# EAGLE schematic backplane_v2 (EAGLE 7.6.0)
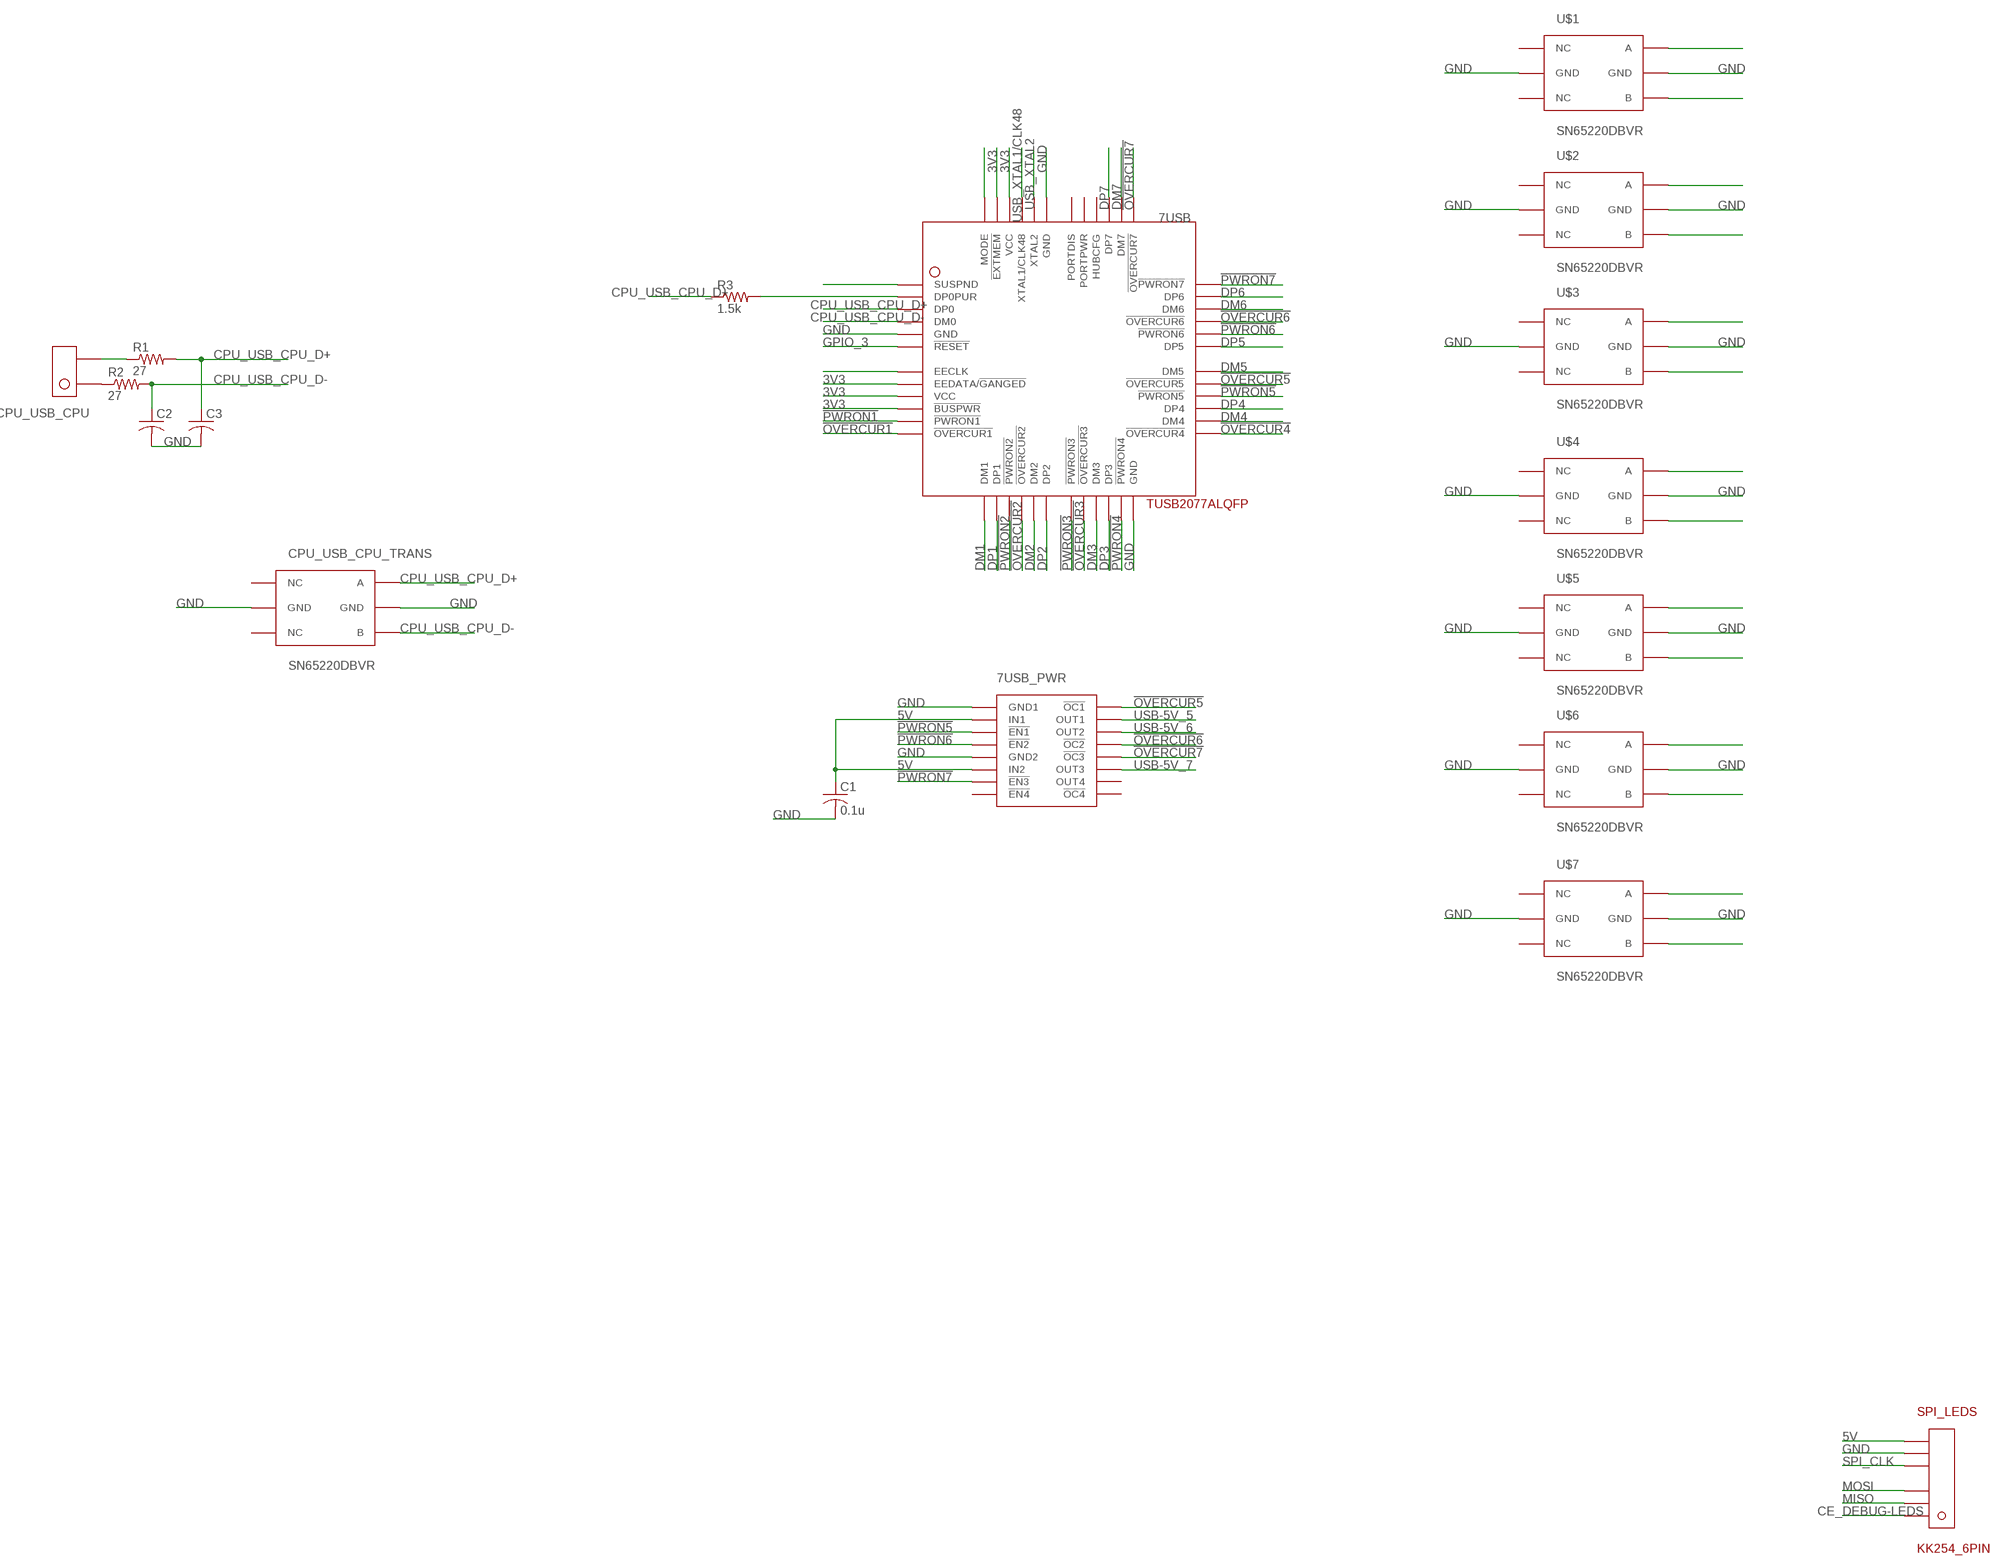
[diagram p0: schematic, sheet 1, part 1 of 2]
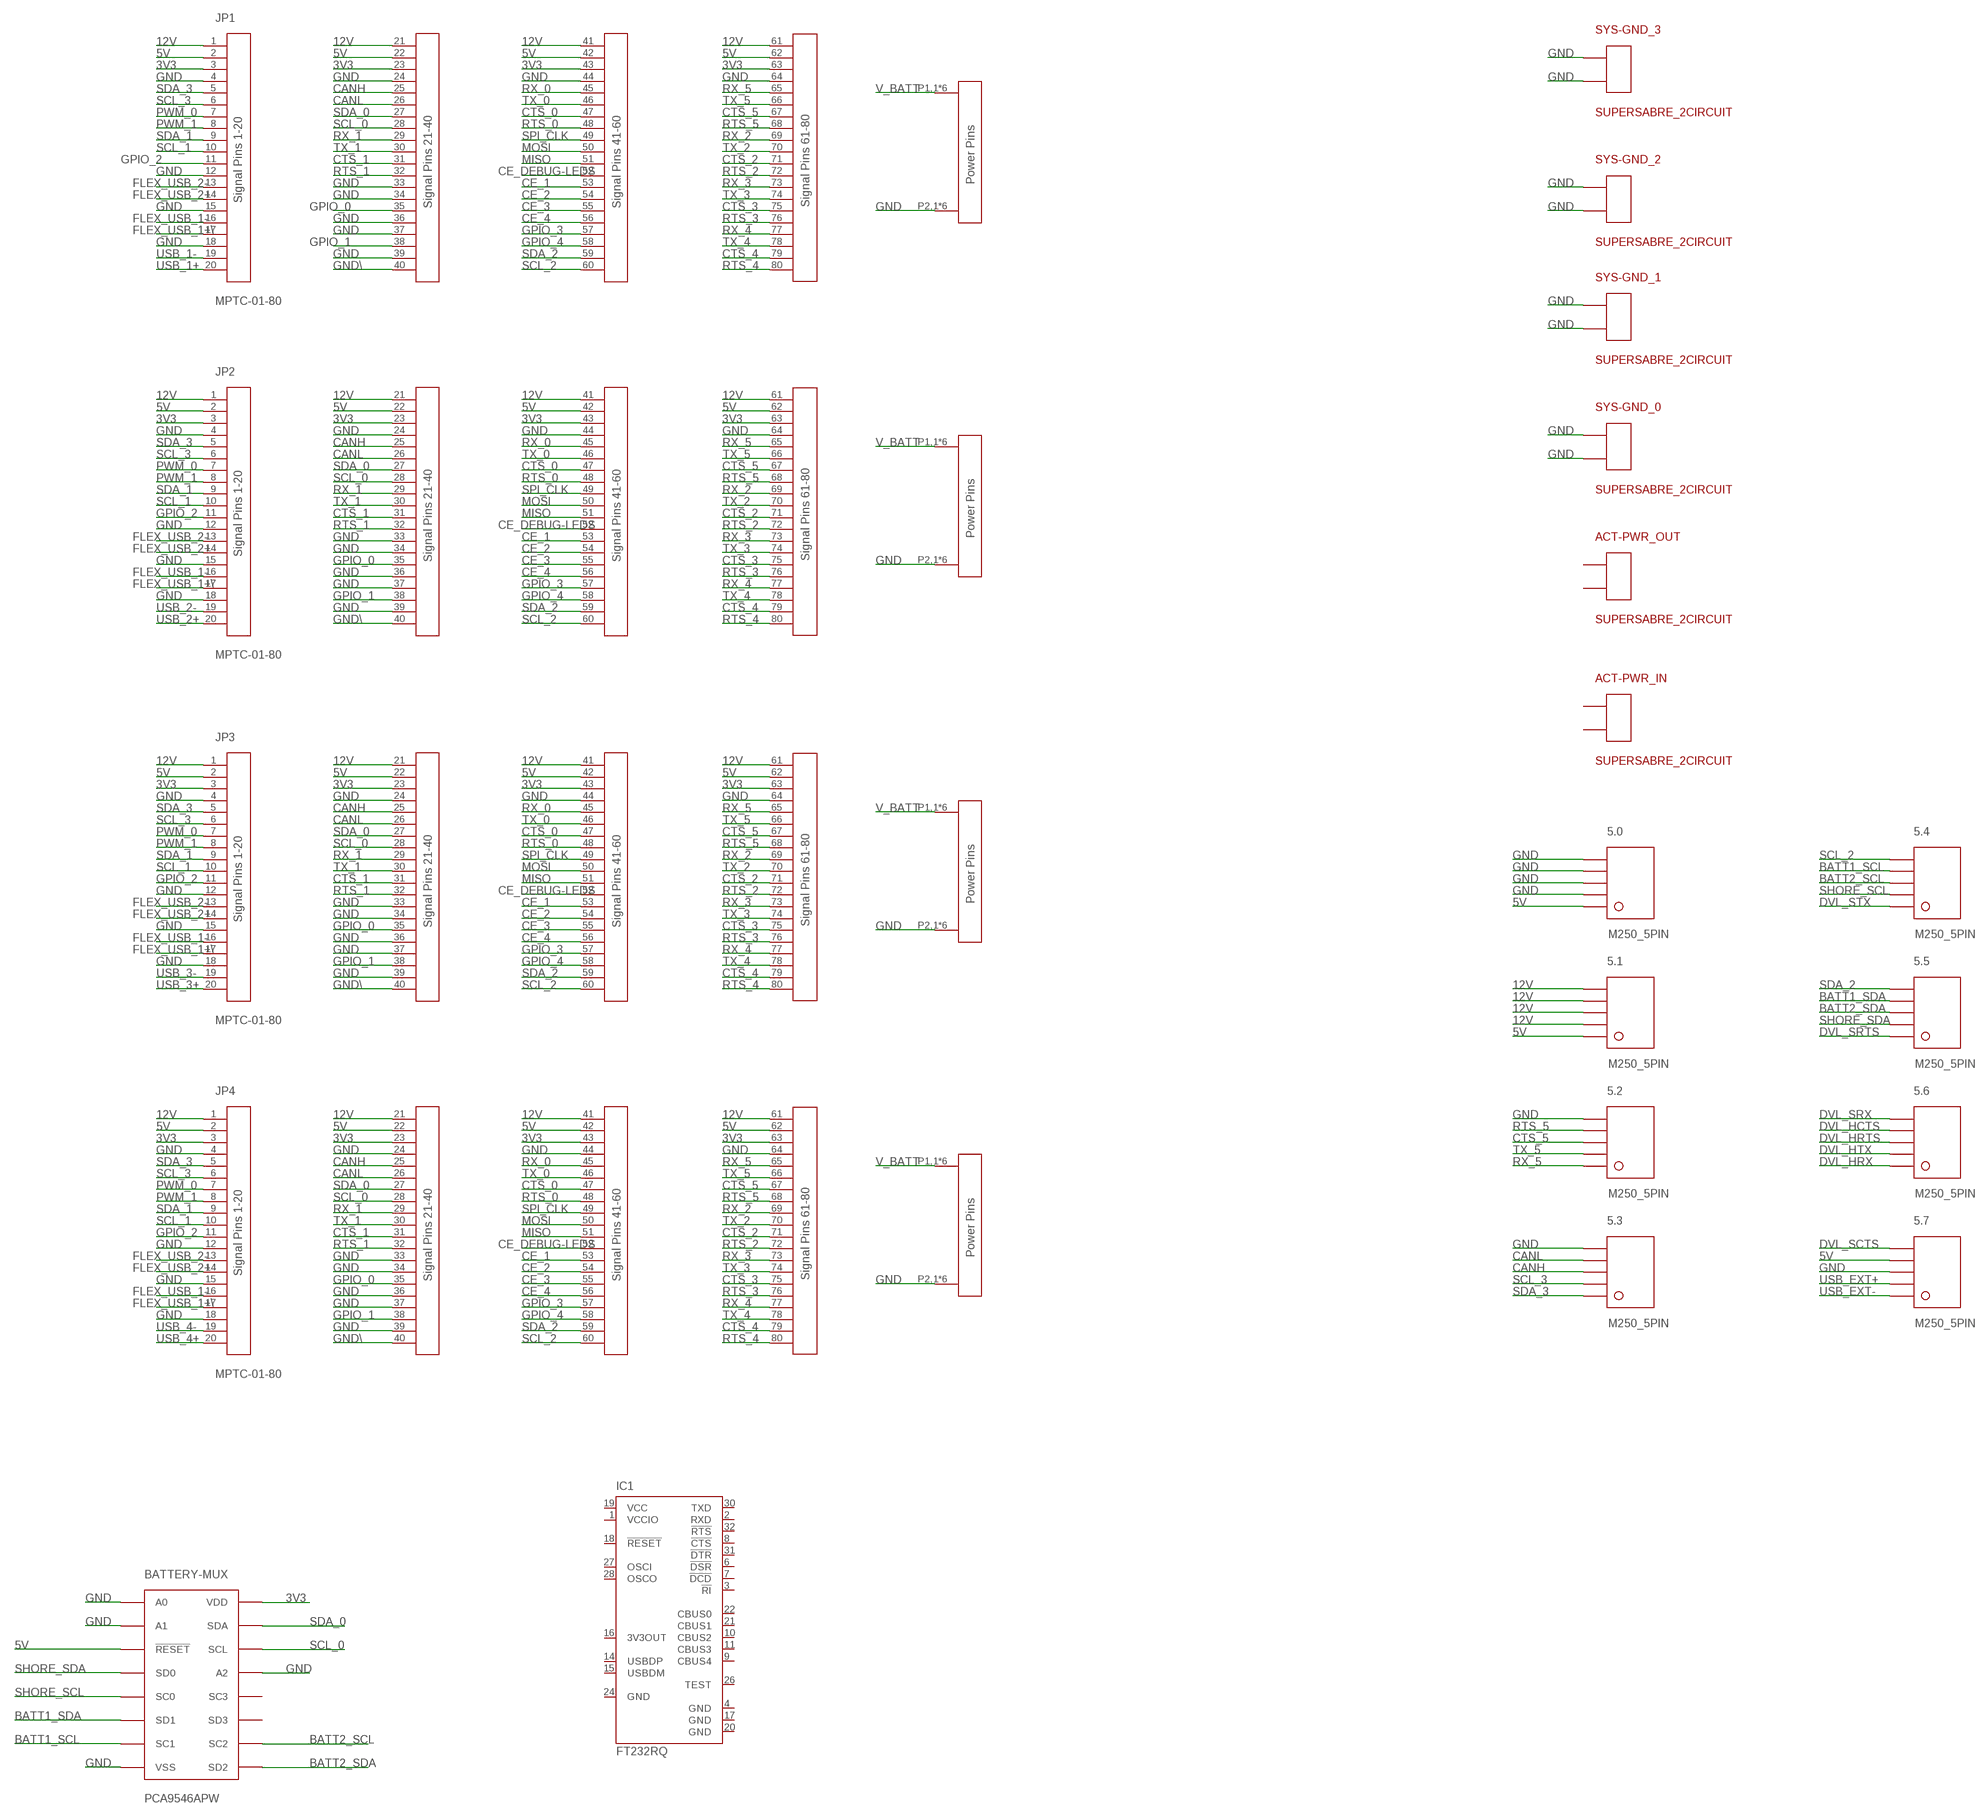
[diagram p1: schematic, sheet 1, part 2 of 2]

## Parts
5.0  M250_5PIN  [M205_5PIN]
5.1  M250_5PIN  [M205_5PIN]
5.2  M250_5PIN  [M205_5PIN]
5.3  M250_5PIN  [M205_5PIN]
5.4  M250_5PIN  [M205_5PIN]
5.5  M250_5PIN  [M205_5PIN]
5.6  M250_5PIN  [M205_5PIN]
5.7  M250_5PIN  [M205_5PIN]
7USB  TUSB2077ALQFP  [48-LQFP_0.5MM_PITCH]
7USB_PWR  TPS2044BBD-SOIC  [TPS2044]
ACT-PWR_IN  SUPERSABRE_2CIRCUIT  [SUPERSABRE_2CIRCUIT]
ACT-PWR_OUT  SUPERSABRE_2CIRCUIT  [SUPERSABRE_2CIRCUIT]
BATTERY-MUX  PCA9546APW  [TSSOP16]
C1  0.1u  C-USC0603  [C0603]
C2  C-USC0805  [C0805]
C3  C-USC0805  [C0805]
CPU_USB_CPU  KK254_VERT_2PIN22-29-2021  [KK254_VERT_2PIN]
CPU_USB_CPU_TRANS  SN65220DBVR  [SOT23-6PIN]
IC1  FT232RQ  [QFN32]
JP1  MPTC-01-80  [MPTC-01-80]
JP2  MPTC-01-80  [MPTC-01-80]
JP3  MPTC-01-80  [MPTC-01-80]
JP4  MPTC-01-80  [MPTC-01-80]
R1  27  R-US_R0805  [R0805]
R2  27  R-US_R0805  [R0805]
R3  1.5k  R-US_R0805  [R0805]
SPI_LEDS  KK254_6PIN  [KK254_6PIN]
SYS-GND_0  SUPERSABRE_2CIRCUIT  [SUPERSABRE_2CIRCUIT]
SYS-GND_1  SUPERSABRE_2CIRCUIT  [SUPERSABRE_2CIRCUIT]
SYS-GND_2  SUPERSABRE_2CIRCUIT  [SUPERSABRE_2CIRCUIT]
SYS-GND_3  SUPERSABRE_2CIRCUIT  [SUPERSABRE_2CIRCUIT]
U$1  SN65220DBVR  [SOT23-6PIN]
U$2  SN65220DBVR  [SOT23-6PIN]
U$3  SN65220DBVR  [SOT23-6PIN]
U$4  SN65220DBVR  [SOT23-6PIN]
U$5  SN65220DBVR  [SOT23-6PIN]
U$6  SN65220DBVR  [SOT23-6PIN]
U$7  SN65220DBVR  [SOT23-6PIN]

## Nets
3V3: 7USB.P$8(EEDATA/!GANGED!) 7USB.P$9(VCC) 7USB.P$10(!BUSPWR!) 7USB.P$46(VCC) 7USB.P$47(!EXTMEM!) BATTERY-MUX.P$16(VDD) JP1.3 JP1.23 JP1.43 JP1.63 JP2.3 JP2.23 JP2.43 JP2.63 JP3.3 JP3.23 JP3.43 JP3.63 JP4.3 JP4.23 JP4.43 JP4.63
5V: 5.0.P$1 5.0.P$2 5.1.P$1 5.1.P$2 5.7.P$7 5.7.P$8 7USB_PWR.IN1 7USB_PWR.IN2 BATTERY-MUX.P$3(!RESET!) C1.1 JP1.2 JP1.22 JP1.42 JP1.62 JP2.2 JP2.22 JP2.42 JP2.62 JP3.2 JP3.22 JP3.42 JP3.62 JP4.2 JP4.22 JP4.42 JP4.62 SPI_LEDS.P$6
12V: 5.1.P$3 5.1.P$4 5.1.P$5 5.1.P$6 5.1.P$7 5.1.P$8 5.1.P$9 5.1.P$10 JP1.1 JP1.21 JP1.41 JP1.61 JP2.1 JP2.21 JP2.41 JP2.61 JP3.1 JP3.21 JP3.41 JP3.61 JP4.1 JP4.21 JP4.41 JP4.61
!OVERCUR1!: 7USB.P$12(!OVERCUR1!)
!OVERCUR2!: 7USB.P$16(!OVERCUR2!)
!OVERCUR3!: 7USB.P$20(!OVERCUR3!)
!OVERCUR4!: 7USB.P$25(!OVERCUR4!)
!OVERCUR5!: 7USB.P$29(!OVERCUR5!) 7USB_PWR.!OC1!
!OVERCUR6!: 7USB.P$33(!OVERCUR6!) 7USB_PWR.!OC2!
!OVERCUR7!: 7USB.P$37(!OVERCUR7!) 7USB_PWR.!OC3!
!PWRON1!: 7USB.P$11(!PWRON1!)
!PWRON2!: 7USB.P$15(!PWRON2!)
!PWRON3!: 7USB.P$19(!PWRON3!)
!PWRON4!: 7USB.P$23(!PWRON4!)
!PWRON5!: 7USB.P$28(!PWRON5!) 7USB_PWR.!EN1!
!PWRON6!: 7USB.P$32(!PWRON6!) 7USB_PWR.!EN2!
!PWRON7!: 7USB.P$36(!PWRON7!) 7USB_PWR.!EN3!
BATT1_SCL: 5.4.P$7 5.4.P$8 BATTERY-MUX.P$7(SC1)
BATT1_SDA: 5.5.P$7 5.5.P$8 BATTERY-MUX.P$6(SD1)
BATT2_SCL: 5.4.P$5 5.4.P$6 BATTERY-MUX.P$10(SC2)
BATT2_SDA: 5.5.P$5 5.5.P$6 BATTERY-MUX.P$9(SD2)
CANH: 5.3.P$5 5.3.P$6 JP1.25 JP2.25 JP3.25 JP4.25
CANL: 5.3.P$7 5.3.P$8 JP1.26 JP2.26 JP3.26 JP4.26
CE_1: JP1.53 JP2.53 JP3.53 JP4.53
CE_2: JP1.54 JP2.54 JP3.54 JP4.54
CE_3: JP1.55 JP2.55 JP3.55 JP4.55
CE_4: JP1.56 JP2.56 JP3.56 JP4.56
CE_DEBUG-LEDS: JP1.52 JP2.52 JP3.52 JP4.52 SPI_LEDS.P$1
CPU_USB_CPU_D+: 7USB.P$3(DP0) C3.1 CPU_USB_CPU_TRANS.P$6(A) R1.2 R3.1
CPU_USB_CPU_D-: 7USB.P$4(DM0) C2.1 CPU_USB_CPU_TRANS.P$4(B) R2.2
CTS_0: JP1.47 JP2.47 JP3.47 JP4.47
CTS_1: JP1.31 JP2.31 JP3.31 JP4.31
CTS_2: JP1.71 JP2.71 JP3.71 JP4.71
CTS_3: JP1.75 JP2.75 JP3.75 JP4.75
CTS_4: JP1.79 JP2.79 JP3.79 JP4.79
CTS_5: 5.2.P$5 5.2.P$6 JP1.67 JP2.67 JP3.67 JP4.67
DM1: 7USB.P$13(DM1)
DM2: 7USB.P$17(DM2)
DM3: 7USB.P$21(DM3)
DM4: 7USB.P$26(DM4)
DM5: 7USB.P$30(DM5)
DM6: 7USB.P$34(DM6)
DM7: 7USB.P$38(DM7)
DP1: 7USB.P$14(DP1)
DP2: 7USB.P$18(DP2)
DP3: 7USB.P$22(DP3)
DP4: 7USB.P$27(DP4)
DP5: 7USB.P$31(DP5)
DP6: 7USB.P$35(DP6)
DP7: 7USB.P$39(DP7)
DVL_HCTS: 5.6.P$7 5.6.P$8
DVL_HRTS: 5.6.P$5 5.6.P$6
DVL_HRX: 5.6.P$1 5.6.P$2
DVL_HTX: 5.6.P$3 5.6.P$4
DVL_SCTS: 5.7.P$9 5.7.P$10
DVL_SRTS: 5.5.P$1 5.5.P$2
DVL_SRX: 5.6.P$9 5.6.P$10
DVL_STX: 5.4.P$1 5.4.P$2
FLEX_USB_1+\: JP1.17 JP2.17 JP3.17 JP4.17
FLEX_USB_1-: JP1.16 JP2.16 JP3.16 JP4.16
FLEX_USB_2+: JP1.14 JP2.14 JP3.14 JP4.14
FLEX_USB_2-: JP1.13 JP2.13 JP3.13 JP4.13
GND: 5.0.P$3 5.0.P$4 5.0.P$5 5.0.P$6 5.0.P$7 5.0.P$8 5.0.P$9 5.0.P$10 5.2.P$9 5.2.P$10 5.3.P$9 5.3.P$10 5.7.P$5 5.7.P$6 7USB.P$5(GND) 7USB.P$24(GND) 7USB.P$43(GND) 7USB.P$48(MODE) 7USB_PWR.GND1 7USB_PWR.GND2 BATTERY-MUX.P$1(A0) BATTERY-MUX.P$2(A1) BATTERY-MUX.P$8(VSS) BATTERY-MUX.P$13(A2) C1.2 C2.2 C3.2 CPU_USB_CPU_TRANS.P$2(GND) CPU_USB_CPU_TRANS.P$5(GND) JP1.4 JP1.12 JP1.15 JP1.18 JP1.24 JP1.33 JP1.34 JP1.36 JP1.37 JP1.39 JP1.44 JP1.64 JP1.P2,1(POWER2) JP1.P2,2(POWER2) JP1.P2,3(POWER2) JP1.P2,4(POWER2) JP1.P2,5(POWER2) JP1.P2,6(POWER2) JP2.4 JP2.12 JP2.15 JP2.18 JP2.24 JP2.33 JP2.34 JP2.36 JP2.37 JP2.39 JP2.44 JP2.64 JP2.P2,1(POWER2) JP2.P2,2(POWER2) JP2.P2,3(POWER2) JP2.P2,4(POWER2) JP2.P2,5(POWER2) JP2.P2,6(POWER2) JP3.4 JP3.12 JP3.15 JP3.18 JP3.24 JP3.33 JP3.34 JP3.36 JP3.37 JP3.39 JP3.44 JP3.64 JP3.P2,1(POWER2) JP3.P2,2(POWER2) JP3.P2,3(POWER2) JP3.P2,4(POWER2) JP3.P2,5(POWER2) JP3.P2,6(POWER2) JP4.4 JP4.12 JP4.15 JP4.18 JP4.24 JP4.33 JP4.34 JP4.36 JP4.37 JP4.39 JP4.44 JP4.64 JP4.P2,1(POWER2) JP4.P2,2(POWER2) JP4.P2,3(POWER2) JP4.P2,4(POWER2) JP4.P2,5(POWER2) JP4.P2,6(POWER2) SPI_LEDS.P$5 SYS-GND_0.P$1 SYS-GND_0.P$2 SYS-GND_1.P$1 SYS-GND_1.P$2 SYS-GND_2.P$1 SYS-GND_2.P$2 SYS-GND_3.P$1 SYS-GND_3.P$2 U$1.P$2(GND) U$1.P$5(GND) U$2.P$2(GND) U$2.P$5(GND) U$3.P$2(GND) U$3.P$5(GND) U$4.P$2(GND) U$4.P$5(GND) U$5.P$2(GND) U$5.P$5(GND) U$6.P$2(GND) U$6.P$5(GND) U$7.P$2(GND) U$7.P$5(GND)
GND\: JP1.40 JP2.40 JP3.40 JP4.40
GPIO_0: JP1.35 JP2.35 JP3.35 JP4.35
GPIO_1: JP1.38 JP2.38 JP3.38 JP4.38
GPIO_2: JP1.11 JP2.11 JP3.11 JP4.11
GPIO_3: 7USB.P$6(!RESET!) JP1.57 JP2.57 JP3.57 JP4.57
GPIO_4: JP1.58 JP2.58 JP3.58 JP4.58
MISO: JP1.51 JP2.51 JP3.51 JP4.51 SPI_LEDS.P$2
MOSI: JP1.50 JP2.50 JP3.50 JP4.50 SPI_LEDS.P$3
N$1: 7USB.P$1(SUSPND)
N$2: 7USB.P$2(DP0PUR) R3.2
N$5: CPU_USB_CPU.P$2 R1.1
N$6: U$2.P$6(A)
N$7: 7USB.P$7(EECLK)
N$8: U$2.P$4(B)
N$9: U$1.P$6(A)
N$10: U$1.P$4(B)
N$11: U$3.P$6(A)
N$12: U$3.P$4(B)
N$13: U$4.P$6(A)
N$14: U$4.P$4(B)
N$15: U$5.P$6(A)
N$16: U$5.P$4(B)
N$17: U$6.P$6(A)
N$18: U$6.P$4(B)
N$19: CPU_USB_CPU.P$1 R2.1
N$20: U$7.P$6(A)
N$21: U$7.P$4(B)
PWM_0: JP1.7 JP2.7 JP3.7 JP4.7
PWM_1: JP1.8 JP2.8 JP3.8 JP4.8
RTS_0: JP1.48 JP2.48 JP3.48 JP4.48
RTS_1: JP1.32 JP2.32 JP3.32 JP4.32
RTS_2: JP1.72 JP2.72 JP3.72 JP4.72
RTS_3: JP1.76 JP2.76 JP3.76 JP4.76
RTS_4: JP1.80 JP2.80 JP3.80 JP4.80
RTS_5: 5.2.P$7 5.2.P$8 JP1.68 JP2.68 JP3.68 JP4.68
RX_0: JP1.45 JP2.45 JP3.45 JP4.45
RX_1: JP1.29 JP2.29 JP3.29 JP4.29
RX_2: JP1.69 JP2.69 JP3.69 JP4.69
RX_3: JP1.73 JP2.73 JP3.73 JP4.73
RX_4: JP1.77 JP2.77 JP3.77 JP4.77
RX_5: 5.2.P$1 5.2.P$2 JP1.65 JP2.65 JP3.65 JP4.65
SCL_0: BATTERY-MUX.P$14(SCL) JP1.28 JP2.28 JP3.28 JP4.28
SCL_1: JP1.10 JP2.10 JP3.10 JP4.10
SCL_2: 5.4.P$9 5.4.P$10 JP1.60 JP2.60 JP3.60 JP4.60
SCL_3: 5.3.P$3 5.3.P$4 JP1.6 JP2.6 JP3.6 JP4.6
SDA_0: BATTERY-MUX.P$15(SDA) JP1.27 JP2.27 JP3.27 JP4.27
SDA_1: JP1.9 JP2.9 JP3.9 JP4.9
SDA_2: 5.5.P$9 5.5.P$10 JP1.59 JP2.59 JP3.59 JP4.59
SDA_3: 5.3.P$1 5.3.P$2 JP1.5 JP2.5 JP3.5 JP4.5
SHORE_SCL: 5.4.P$3 5.4.P$4 BATTERY-MUX.P$5(SC0)
SHORE_SDA: 5.5.P$3 5.5.P$4 BATTERY-MUX.P$4(SD0)
SPI_CLK: JP1.49 JP2.49 JP3.49 JP4.49 SPI_LEDS.P$4
TX_0: JP1.46 JP2.46 JP3.46 JP4.46
TX_1: JP1.30 JP2.30 JP3.30 JP4.30
TX_2: JP1.70 JP2.70 JP3.70 JP4.70
TX_3: JP1.74 JP2.74 JP3.74 JP4.74
TX_4: JP1.78 JP2.78 JP3.78 JP4.78
TX_5: 5.2.P$3 5.2.P$4 JP1.66 JP2.66 JP3.66 JP4.66
USB-5V_5: 7USB_PWR.OUT1
USB-5V_6: 7USB_PWR.OUT2
USB-5V_7: 7USB_PWR.OUT3
USB_1+: JP1.20
USB_1-: JP1.19
USB_2+: JP2.20
USB_2-: JP2.19
USB_3+: JP3.20
USB_3-: JP3.19
USB_4+: JP4.20
USB_4-: JP4.19
USB_EXT+: 5.7.P$3 5.7.P$4
USB_EXT-: 5.7.P$1 5.7.P$2
USB_XTAL1/CLK48: 7USB.P$45(XTAL1/CLK48)
USB_XTAL2: 7USB.P$44(XTAL2)
V_BATT: JP1.P1,1(POWER1) JP1.P1,2(POWER1) JP1.P1,3(POWER1) JP1.P1,4(POWER1) JP1.P1,5(POWER1) JP1.P1,6(POWER1) JP2.P1,1(POWER1) JP2.P1,2(POWER1) JP2.P1,3(POWER1) JP2.P1,4(POWER1) JP2.P1,5(POWER1) JP2.P1,6(POWER1) JP3.P1,1(POWER1) JP3.P1,2(POWER1) JP3.P1,3(POWER1) JP3.P1,4(POWER1) JP3.P1,5(POWER1) JP3.P1,6(POWER1) JP4.P1,1(POWER1) JP4.P1,2(POWER1) JP4.P1,3(POWER1) JP4.P1,4(POWER1) JP4.P1,5(POWER1) JP4.P1,6(POWER1)
Unconnected: 7USB.P$40(HUBCFG) 7USB.P$41(PORTPWR) 7USB.P$42(PORTDIS) 7USB_PWR.!EN4! 7USB_PWR.!OC4! 7USB_PWR.OUT4 ACT-PWR_IN.P$1 ACT-PWR_IN.P$2 ACT-PWR_OUT.P$1 ACT-PWR_OUT.P$2 BATTERY-MUX.P$11(SD3) BATTERY-MUX.P$12(SC3) CPU_USB_CPU_TRANS.P$1(NC) CPU_USB_CPU_TRANS.P$3(NC) IC1.2(RXD) IC1.3(!RI) IC1.6(!DSR) IC1.7(!DCD) IC1.8(!CTS) IC1.9(CBUS4) IC1.10(CBUS2) IC1.11(CBUS3) IC1.14(USBDP) IC1.15(USBDM) IC1.16(3V3OUT) IC1.18(!RESET) IC1.21(CBUS1) IC1.22(CBUS0) IC1.26(TEST) IC1.27(OSCI) IC1.28(OSCO) IC1.30(TXD) IC1.31(!DTR) IC1.32(!RTS) U$1.P$1(NC) U$1.P$3(NC) U$2.P$1(NC) U$2.P$3(NC) U$3.P$1(NC) U$3.P$3(NC) U$4.P$1(NC) U$4.P$3(NC) U$5.P$1(NC) U$5.P$3(NC) U$6.P$1(NC) U$6.P$3(NC) U$7.P$1(NC) U$7.P$3(NC)

## Power pins joined to a net without a drawn wire
GND: IC1.4(GND) IC1.17(GND) IC1.20(GND) IC1.24(GND)
VCC: IC1.19(VCC)
VCCIO: IC1.1(VCCIO)

## Library data of the parts
5.0 5.1-5.7 = molex:M250_5PIN: 5-pin Eurostyle Terminal Block Title: 2.54mm Pitch, Eurostyle™ Fixed-Mount Push-Button Terminal Block, Vertical, 6A, 26-18 AWG, Green, 5 Circuits Part number: 397000205
7USB = texas:TUSB2077A: The Texas Instruments TUSB2007A in the 48-pin LQFP package. 7-port USB 2.0 hub/controller. Datasheet <http://www.ti.com/lit/ds/symlink/tusb2077a.pdf> Created by Ben Hurwitz, 10-6-16 Robotics@Maryland
7USB_PWR = texas:TPS2044B: Texas Instruments TPS2044BD-SOIC Current-limited power distribution switches 0.5A continuous current, 1.25A max current, 3.3-5V Datasheet <http://www.ti.com/lit/ds/symlink/tps2044b.pdf> NOTE: These replace the older TPS2044/54 switches.
ACT-PWR_IN ACT-PWR_OUT SYS-GND_0 SYS-GND_1-SYS-GND_3 = molex:SUPERSABRE_2CIRCUIT
BATTERY-MUX = NXP:PCA9546APW: NXP 1:4 I2C Multiplexer TSSOP16 package Part number: PCA9546APW
C1-C3 = resistor:C-US: CAPACITOR, American symbol
CPU_USB_CPU = molex:KK254_VERT_2PIN: KK® 254 Wire-to-Board Header, Vertical, with Friction Lock, 2 Circuits, Gold (Au) Plating Part Number: 22-29-2021 http://www.molex.com/molex/products/datasheet.jsp?part=active/0022292021_PCB_HEADERS.xml
CPU_USB_CPU_TRANS U$1-U$7 = texas:SN65220DBVR: Texas Instruments SN65220 Dual Line USB Port Transient Suppressor Datasheet <http://www.ti.com/lit/ds/symlink/sn65220.pdf>
IC1 = ftdichip:FT232R: Source: http://www.ftdichip.com/Documents/DataSheets/DS_FT232R_v104.pdf; MPN: FT232RQ; OC_FARNELL: 1146033; OC_NEWARK: 91K9919
JP1-JP4 = samtec:MPTC-01-80: Samtec 30A Signal/Power Combo System Part number: MPTC-01-80-01 Datasheet <http://suddendocs.samtec.com/catalog_english/mptc.pdf>, Drawing <http://suddendocs.samtec.com/prints/mptc-xx-xx-xx-6.30-xx-x-v-xx-mkt.pdf>, Footprint <http://suddendocs.samtec.com/prints/mptc-xx-xx-xx-6.30-xx-x-v-xx-footprint.pdf> Created by: Ben Hurwitz Created on: 3 Dec 2015 Project: Backplane Group: Robotics @ Maryland Autonomous Submarine University of Maryland, College Park, MD, USA Description; This is an 82-pin female signal/power combination plug, with 80 5A signal pins and 2 24.7A power blades (each uses six pins). It was designed to be used on a backplane for the autonomous submarine to connect the four main daughterboards to the CPU and batteries via the backplane. It fits with the Samtec MPSC male half.
R1-R3 = resistor:R-US_: RESISTOR, American symbol
SPI_LEDS = molex:KK254_6PIN: Molex KK254 series 6-pin package Datasheet <http://www.molex.com/pdm_docs/sd/022032061_sd.pdf> Link <http://www.molex.com/molex/products/listview.jsp?query=&offset=0&filter=&fs=&npp=20&sType=a&autoNav=&path=+inmeta%3Apromotable%253Dyes+inmeta%3ACollectionName%253DImpulse++inmeta%3Acategory%253DPCB%252520Headers+inmeta%3Abreakaway%253DNo+inmeta%3Acircuitsloaded%253D6%2526partialfields%3D%28productname%3AKK%252520254%29&channel=products>